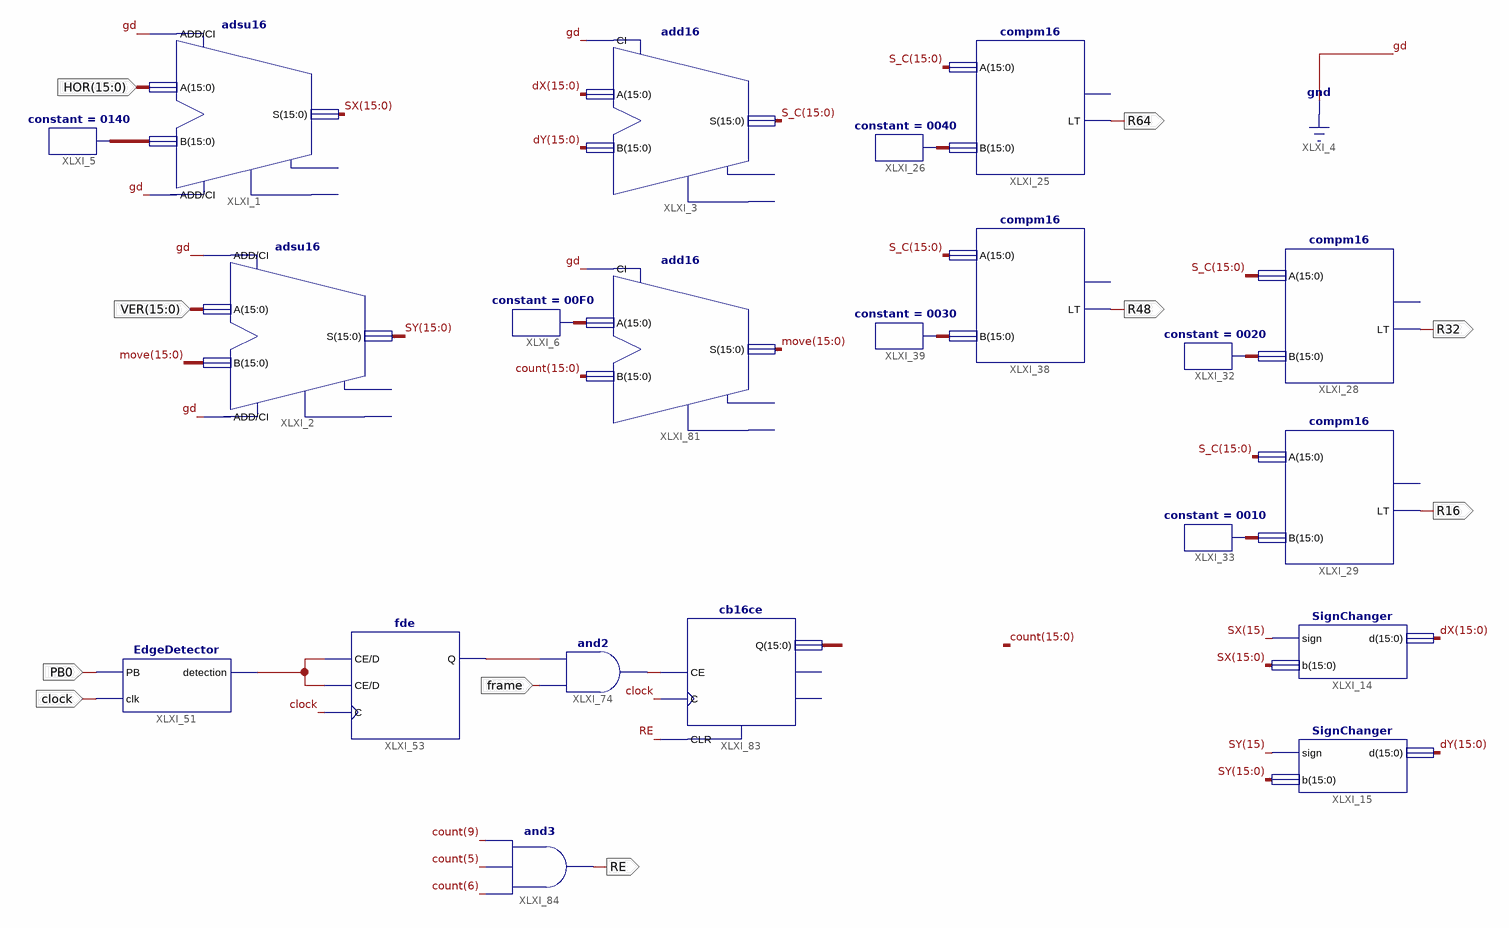
[diagram p0: schematic sheet 1]
// Xilinx ISE schematic Meteor_Logic.sch (spartan3e) as structural Verilog: 21 symbols, 11 ports
module Meteor_Logic (
  input  [15:0] HOR,
  input  [15:0] VER,
  input  clock,
  input  PB0,
  input  frame,
  output gd,
  output R64,
  output R48,
  output R32,
  output R16,
  output RE
);

  wire C_EN, XLXN_98, XLXN_164;
  wire [15:0] count, dX, dY, move, S_C, SX, SY, XLXN_9, XLXN_72, XLXN_74, XLXN_75, XLXN_78, XLXN_183,
       XLXN_184;

  adsu16 XLXI_1 (.A(HOR), .ADD(1'b0), .B(XLXN_9), .CI(1'b0), .S(SX));  // open: CO, OFL
  constant #(.CValue("0140")) XLXI_5 (.O(XLXN_9));
  add16 XLXI_3 (.A(dX), .B(dY), .CI(1'b0), .S(S_C));  // open: CO, OFL
  compm16 XLXI_25 (.A(S_C), .B(XLXN_72), .LT(R64));  // open: GT
  constant #(.CValue("0040")) XLXI_26 (.O(XLXN_72));
  compm16 XLXI_38 (.A(S_C), .B(XLXN_78), .LT(R48));  // open: GT
  constant #(.CValue("0030")) XLXI_39 (.O(XLXN_78));
  compm16 XLXI_28 (.A(S_C), .B(XLXN_74), .LT(R32));  // open: GT
  constant #(.CValue("0020")) XLXI_32 (.O(XLXN_74));
  compm16 XLXI_29 (.A(S_C), .B(XLXN_75), .LT(R16));  // open: GT
  constant #(.CValue("0010")) XLXI_33 (.O(XLXN_75));
  adsu16 XLXI_2 (.A(VER), .ADD(1'b0), .B(move), .CI(1'b0), .S(SY));  // open: CO, OFL
  EdgeDetector XLXI_51 (.PB(PB0), .clk(clock), .detection(XLXN_98));
  fde XLXI_53 (.C(clock), .CE(XLXN_98), .D(XLXN_98), .Q(XLXN_164));
  and XLXI_74 (C_EN, frame, XLXN_164);
  SignChanger XLXI_14 (.sign(SX[15]), .b(SX), .d(dX));
  SignChanger XLXI_15 (.sign(SY[15]), .b(SY), .d(dY));
  add16 XLXI_81 (.A(XLXN_183), .B(count), .CI(1'b0), .S(move));  // open: CO, OFL
  constant #(.CValue("00F0")) XLXI_6 (.O(XLXN_183));
  cb16ce XLXI_83 (.C(clock), .CE(C_EN), .CLR(RE), .Q(XLXN_184));  // open: CEO, TC
  and XLXI_84 (RE, count[6], count[5], count[9]);

  assign gd = 1'b0;
endmodule
